# Altium schematic sheet [03] - Inter-connects.SchDoc: EE-02 - Inter-connects
size A4; DocumentNumber: 4; SheetNumber: 4; SheetTotal: 5
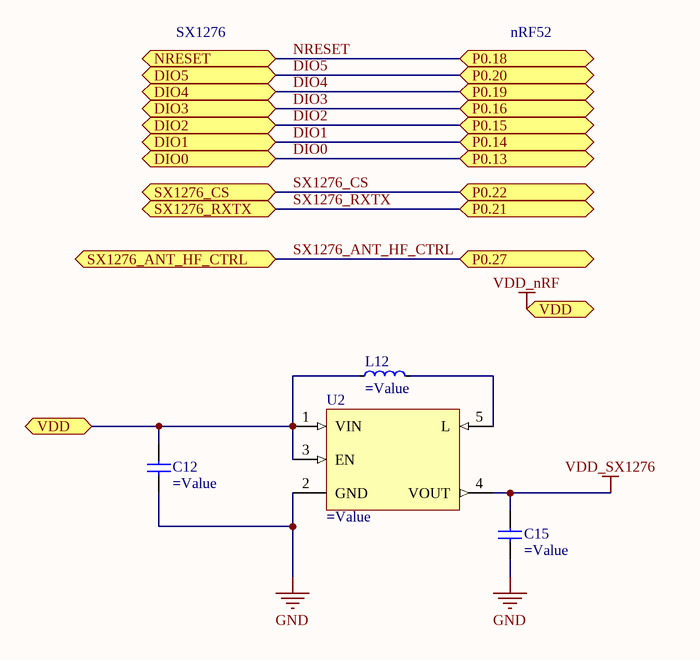
[diagram p0: [03] - Inter-connects.SchDoc]

## Parts
C12  (no value)  [CAPC1005X04L]
C15  (no value)  [CAPC1005X04L]
L12  (no value)  [INDC1608X06L]
U2  (no value)  [SOT95P280X145-5L]

## Ports
DIO0, DIO1, DIO2, DIO3, DIO4, DIO5, NRESET, P0.13, P0.14, P0.15, P0.16, P0.18, P0.19, P0.20, P0.21, P0.22, P0.27, SX1276_ANT_HF_CTRL, SX1276_CS, SX1276_RXTX, VDD

## Nets
GND: C12.1 C15.1 U2.2(GND)
VDD_nRF: C12.2 L12.1 U2.1(VIN) U2.3(EN) ; port VDD
VDD_SX1276: C15.2 U2.4(VOUT)
DIO0: port P0.13, port DIO0
DIO1: port P0.14, port DIO1
DIO2: port P0.15, port DIO2
DIO3: port P0.16, port DIO3
DIO4: port P0.19, port DIO4
DIO5: port P0.20, port DIO5
NRESET: port P0.18, port NRESET
SX1276_ANT_HF_CTRL: port P0.27, port SX1276_ANT_HF_CTRL
SX1276_CS: port P0.22, port SX1276_CS
SX1276_RXTX: port P0.21, port SX1276_RXTX
NetL12_2: L12.2 U2.5(L)

## Notes on the sheet
- SX1276
- nRF52
- Title
- Size:
- Date:
- A4
- Number:
- Time:
- Revision:
- Sheet
- of
- File:

## Library data of the parts
C12 C15 = GRM155R60J106ME15D: CAP CER 10UF 6.3V X5R 0402; Manufacturer: Murata Electronics North America; Capacitance: 10µF; Tolerance: ±20%; Value: 10µF; Supplier 1: Digi-Key; Manufacturer Part Number: GRM155R60J106ME15D; RoHS: RoHS Compliant; Category: Capacitors; Stock 1: 46293; Pricing 1: 1=0.23, 10=0.159, 50=0.0966, 100=0.0811, 250=0.06564, 500=0.0579, 1000=0.04922, 5000=0.0415 (USD); Packaging: Digi-Reel®; Voltage - Rated: 6.3V; Temperature Coefficient: X5R; Mounting Type: Surface Mount, MLCC; Operating Temperature: -55°C ~ 85°C; Applications: General Purpose; Ratings: -; Package / Case: 0402 (1005 Metric); Size / Dimension: 0.039" L x 0.020" W (1.00mm x 0.50mm); Height - Seated (Max): -; Thickness (Max): 0.026" (0.65mm); Lead Spacing: -; Features: Derating Recommended; Lead Style: -; ComponentLink1URL: http://psearch.en.murata.com/capacitor/product/GRM155R60J106ME15#.pdf; ComponentLink1Description: http://psearch.en.murata.com/capacitor/product/GRM155R60J106ME15#.pdf; Supplier Part Number 1: 490-13238-6-ND; Part Status: Active; Failure Rate: *
L12 = MLZ1608M4R7WT000: FIXED IND 4.7UH 350MA 500 MOHM; Manufacturer: TDK Corporation; Type: Multilayer; Material - Core: Ferrite; Inductance: 4.7µH; Tolerance: ±20%; Current - Saturation: 120mA; Shielding: Shielded; DC Resistance (DCR): 650 mOhm Max; Frequency - Test: 2MHz; Value: 4.7µH; Supplier 1: Digi-Key; Manufacturer Part Number: MLZ1608M4R7WT000; RoHS: RoHS Compliant; Category: Inductors, Coils, Chokes; Stock 1: 40675; Pricing 1: 1=0.17, 10=0.15, 50=0.117, 100=0.105, 500=0.09, 1000=0.078 (USD); Packaging: Digi-Reel®; Part Status: Active; Current Rating: 350mA; Q @ Freq: -; Frequency - Self Resonant: -; Ratings: -; Operating Temperature: -55°C ~ 125°C; Mounting Type: Surface Mount; Package / Case: 0603 (1608 Metric); Size / Dimension: 0.063" L x 0.031" W (1.60mm x 0.80mm); Height - Seated (Max): 0.037" (0.95mm); ComponentLink1URL: https://product.tdk.com/info/en/catalog/datasheets/inductor_commercial_decoupling_mlz1608_en.pdf; ComponentLink1Description: https://product.tdk.com/info/en/catalog/datasheets/inductor_commercial_decoupling_mlz1608_en.pdf; Supplier Part Number 1: 445-6390-6-ND
U2 = TPS61097A-33DBVR: IC REG BST 3.3V 0.2A SYNC SOT23; Manufacturer: Texas Instruments; Function: Step-Up; Output Configuration: Positive; Topology: Boost; Output Type: Fixed; Number of Outputs: 1; Voltage - Input (Min): 0.9V; Voltage - Input (Max): 5.5V; Current - Output: 200mA (Switch); Synchronous Rectifier: Yes; Supplier 1: Digi-Key; Manufacturer Part Number: TPS61097A-33DBVR; RoHS: RoHS Compliant; Category: Integrated Circuits (ICs); Stock 1: 4005; Pricing 1: 1=1.92, 10=1.72, 100=1.3797, 500=1.134, 1000=0.7875 (USD); Packaging: Digi-Reel®; Part Status: Active; Voltage - Output (Min/Fixed): 3.3V; Voltage - Output (Max): -; Frequency - Switching: -; Operating Temperature: -40°C ~ 85°C (TA); Mounting Type: Surface Mount; Package / Case: SC-74A, SOT-753; Supplier Device Package: SOT-23-5; ComponentLink1URL: http://www.ti.com/lit/ds/symlink/tps61097a-33.pdf; ComponentLink1Description: http://www.ti.com/lit/ds/symlink/tps61097a-33.pdf; Supplier Part Number 1: 296-44398-6-ND; Value: TPS61097A-33DBVR